# EAGLE design arbotixP (EAGLE 5.10)
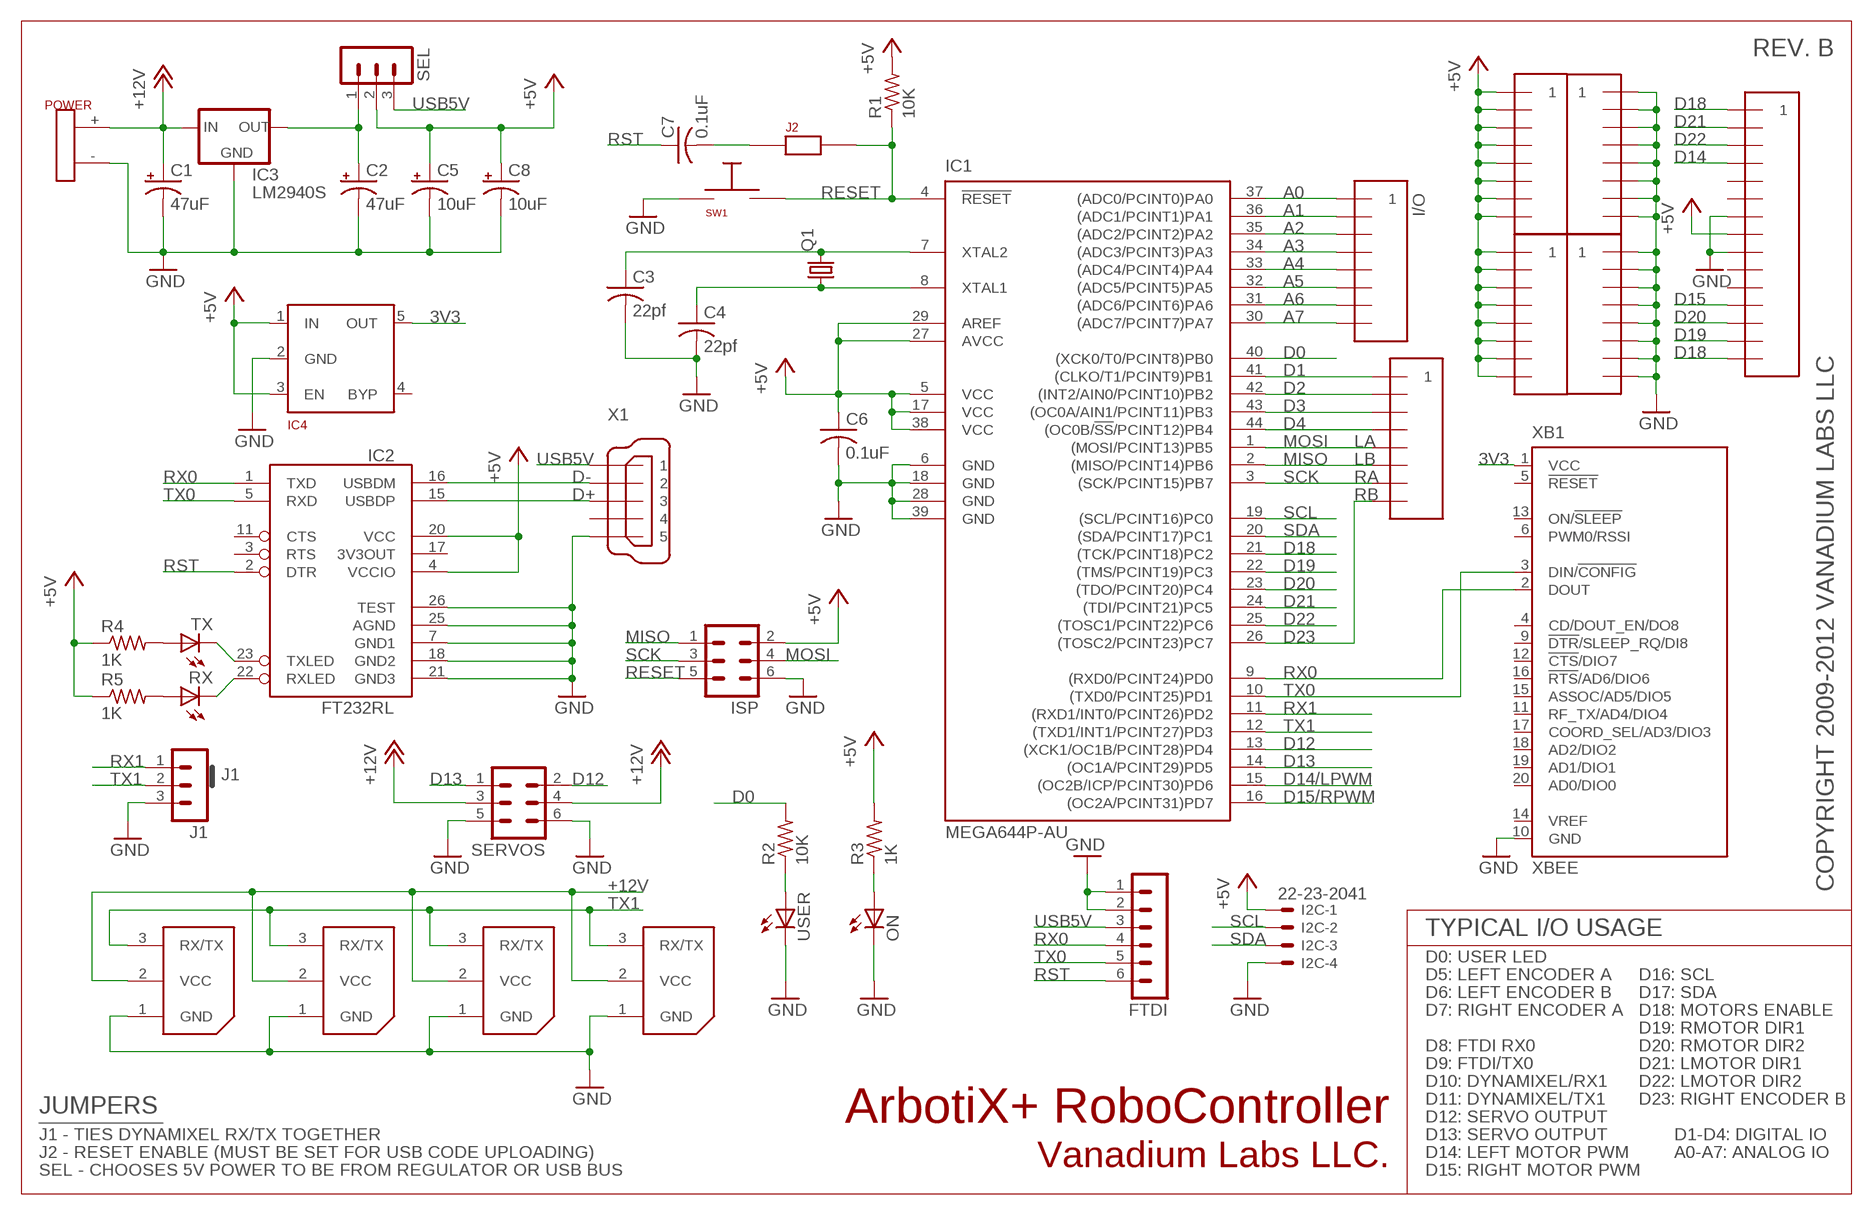
[diagram p0: schematic, sheet 1]

## Parts
AX1  WM18887-ND  [BIOLOID]
AX2  WM18887-ND  [BIOLOID]
AX3  WM18887-ND  [BIOLOID]
AX4  WM18887-ND  [BIOLOID]
C1  47uF  CPOL-USTT2D5  [TT2D5]
C2  47uF  CPOL-USTT2D5  [TT2D5]
C3  22pf  C-USC0603  [C0603]
C4  22pf  C-USC0603  [C0603]
C5  10uF  CPOL-USTT2D5  [TT2D5]
C6  0.1uF  C-USC0603  [C0603]
C7  0.1uF  C-USC0603  [C0603]
C8  10uF  CPOL-USTT2D5  [TT2D5]
FTDI  MA06-1  [MA06-1]
I2C  22-23-2041  [22-23-2041]
IC1  MEGA644P-AU  MEGA164P/324P/644P-AU  [TQFP44]
IC2  FT232RL  FT232RL-BASICSSOP  [SSOP28DB]
IC3  LM2940S  [TO220S]
IC4  MIC5205-3.3  [SOT-23-5]
ISP  MA03-2  [MA03-2]
J1  MA03-1  [MA03-1]
J2  JUMPER  [2-PIN]
ON  LEDCHIP-LED0805  [CHIP-LED0805]
POWER  POWER  [POWER]
Q1  HC49/S  [HC49/S]
R1  10K  R-US_R0805  [R0805]
R2  10K  R-US_R0805  [R0805]
R3  1K  R-US_R0805  [R0805]
R4  1K  R-US_R0603  [R0603]
R5  1K  R-US_R0603  [R0603]
RX  LEDCHIP-LED0603  [CHIP-LED0603]
SEL  MA03-1  [MA03-1]
SERVOS  MA03-2  [MA03-2]
SW1  400-1646-ND  [MINISW]
TX  LEDCHIP-LED0603  [CHIP-LED0603]
U$1  HEADER15  [1X15]
U$2  HEADER8  [1X8]
U$5  HEADER8  [1X8]
U$8  HEADER16  [2X8]
U$9  HEADER16  [2X8]
USER  LEDCHIP-LED0805  [CHIP-LED0805]
X1  MINI-USB-UX60-MB-5ST  [UX60-MB-5ST]
XB1  XBEE  [XBEE]

## Nets
3V3: IC4.5(OUT) XB1.1(VCC)
+5V: C5.+ C6.1 C8.+ I2C.1 IC1.5(VCC) IC1.17(VCC) IC1.27(AVCC) IC1.29(AREF) IC1.38(VCC) IC2.4(VCCIO) IC2.20(VCC) IC4.1(IN) IC4.3(EN) ISP.2 R1.2 R3.2 R4.1 R5.1 SEL.2 U$1.P$8 U$8.P$1 U$8.P$2 U$8.P$3 U$8.P$4 U$8.P$5 U$8.P$6 U$8.P$7 U$8.P$8 U$9.P$1 U$9.P$2 U$9.P$3 U$9.P$4 U$9.P$5 U$9.P$6 U$9.P$7 U$9.P$8
+12V: AX1.2(VCC) AX2.2(VCC) AX3.2(VCC) AX4.2(VCC) C1.+ IC3.1(IN) POWER.+ SERVOS.3 SERVOS.4
A0: IC1.37((ADC0/PCINT0)PA0) U$5.P$1
A1: IC1.36((ADC1/PCINT1)PA1) U$5.P$2
A2: IC1.35((ADC2/PCINT2)PA2) U$5.P$3
A3: IC1.34((ADC3/PCINT3)PA3) U$5.P$4
A4: IC1.33((ADC4/PCINT4)PA4) U$5.P$5
A5: IC1.32((ADC5/PCINT5)PA5) U$5.P$6
A6: IC1.31((ADC6/PCINT6)PA6) U$5.P$7
A7: IC1.30((ADC7/PCINT7)PA7) U$5.P$8
D0: IC1.40((XCK0/T0/PCINT8)PB0) R2.2
D1: IC1.41((CLKO/T1/PCINT9)PB1) U$2.P$1
D2: IC1.42((INT2/AIN0/PCINT10)PB2) U$2.P$2
D3: IC1.43((OC0A/AIN1/PCINT11)PB3) U$2.P$3
D4: IC1.44((OC0B/!SS!/PCINT12)PB4) U$2.P$4
D12: IC1.13((XCK1/OC1B/PCINT28)PD4) SERVOS.2
D13: IC1.14((OC1A/PCINT29)PD5) SERVOS.1
D14: IC1.15((OC2B/ICP/PCINT30)PD6) U$1.P$4
D15: IC1.16((OC2A/PCINT31)PD7) U$1.P$12
D18: IC1.21((TCK/PCINT18)PC2) U$1.P$1 U$1.P$15
D19: IC1.22((TMS/PCINT19)PC3) U$1.P$14
D20: IC1.23((TDO/PCINT20)PC4) U$1.P$13
D21: IC1.24((TDI/PCINT21)PC5) U$1.P$2
D22: IC1.25((TOSC1/PCINT22)PC6) U$1.P$3
D23: IC1.26((TOSC2/PCINT23)PC7) U$2.P$8
D+: IC2.15(USBDP) X1.3
D-: IC2.16(USBDM) X1.2
GND: AX1.1(GND) AX2.1(GND) AX3.1(GND) AX4.1(GND) C1.- C2.- C3.2 C4.2 C5.- C6.2 C8.- FTDI.1 FTDI.2 I2C.4 IC1.6(GND) IC1.18(GND) IC1.28(GND) IC1.39(GND) IC2.7(GND1) IC2.18(GND2) IC2.21(GND3) IC2.25(AGND) IC2.26(TEST) IC3.2(GND) IC4.2(GND) ISP.6 J1.3 ON.C POWER.- SERVOS.5 SERVOS.6 SW1.2 U$1.P$7 U$1.P$9 U$8.P$9 U$8.P$10 U$8.P$11 U$8.P$12 U$8.P$13 U$8.P$14 U$8.P$15 U$8.P$16 U$9.P$9 U$9.P$10 U$9.P$11 U$9.P$12 U$9.P$13 U$9.P$14 U$9.P$15 U$9.P$16 USER.C X1.5 XB1.10(GND)
MISO: IC1.2((MISO/PCINT14)PB6) ISP.1 U$2.P$6
MOSI: IC1.1((MOSI/PCINT13)PB5) ISP.4 U$2.P$5
N$1: C3.1 IC1.7(XTAL2) Q1.2
N$2: R2.1 USER.A
N$4: C4.1 IC1.8(XTAL1) Q1.1
N$7: C7.2 J2.P$1
N$10: R5.2 RX.A
N$11: R4.2 TX.A
N$17: C2.+ IC3.3(OUT) SEL.1
N$44: IC2.23(TXLED) TX.C
N$45: IC2.22(RXLED) RX.C
N$47: ON.A R3.1
RESET: IC1.4(!RESET) ISP.5 J2.P$2 R1.1 SW1.1
RST: C7.1 FTDI.6 IC2.2(DTR)
RX0: FTDI.4 IC1.9((RXD0/PCINT24)PD0) IC2.1(TXD) XB1.2(DOUT)
RX1: IC1.11((RXD1/INT0/PCINT26)PD2) J1.1
SCK: IC1.3((SCK/PCINT15)PB7) ISP.3 U$2.P$7
SCL: I2C.2 IC1.19((SCL/PCINT16)PC0)
SDA: I2C.3 IC1.20((SDA/PCINT17)PC1)
TX0: FTDI.5 IC1.10((TXD0/PCINT25)PD1) IC2.5(RXD) XB1.3(DIN/!CONFIG)
TX1: AX1.3(RX/TX) AX2.3(RX/TX) AX3.3(RX/TX) AX4.3(RX/TX) IC1.12((TXD1/INT1/PCINT27)PD3) J1.2
USB5V: FTDI.3 SEL.3 X1.1
Unconnected: IC2.3(RTS) IC2.11(CTS) IC2.17(3V3OUT) IC4.4(BYP) U$1.P$5 U$1.P$6 U$1.P$10 U$1.P$11 X1.4 XB1.4(CD/DOUT_EN/DO8) XB1.5(!RESET) XB1.6(PWM0/RSSI) XB1.9(!DTR!/SLEEP_RQ/DI8) XB1.11(RF_TX/AD4/DIO4) XB1.12(!CTS!/DIO7) XB1.13(ON/!SLEEP) XB1.14(VREF) XB1.15(ASSOC/AD5/DIO5) XB1.16(!RTS!/AD6/DIO6) XB1.17(COORD_SEL/AD3/DIO3) XB1.18(AD2/DIO2) XB1.19(AD1/DIO1) XB1.20(AD0/DIO0)

## Notes on the sheet
- REV. B
- I/O
- LA
- LB
- RA
- RB
- J1 | D14/LPWM
- D15/RPWM
- COPYRIGHT 2009-2012 VANADIUM LABS LLC
- TYPICAL I/O USAGE
- D0: USER LED
- D5: LEFT ENCODER A | D16: SCL
- D6: LEFT ENCODER B | D17: SDA
- D7: RIGHT ENCODER A | D18: MOTORS ENABLE
- D19: RMOTOR DIR1
- D8: FTDI RX0 | D20: RMOTOR DIR2
- D9: FTDI/TX0 | D21: LMOTOR DIR1
- ArbotiX+ RoboController | D10: DYNAMIXEL/RX1 | D22: LMOTOR DIR2
- D11: DYNAMIXEL/TX1 | D23: RIGHT ENCODER B
- JUMPERS
- D12: SERVO OUTPUT
- J1 - TIES DYNAMIXEL RX/TX TOGETHER | Vanadium Labs LLC. | D13: SERVO OUTPUT | D1-D4: DIGITAL IO
- J2 - RESET ENABLE (MUST BE SET FOR USB CODE UPLOADING) | D14: LEFT MOTOR PWM | A0-A7: ANALOG IO
- SEL - CHOOSES 5V POWER TO BE FROM REGULATOR OR USB BUS | D15: RIGHT MOTOR PWM

## Library data of the parts
AX1-AX4 = robots:WM18887-ND: Bioloid Bus Header Digikey Part No: WM18887-ND Molex/Waldom Electronics Corp 22-03-5035
C1 C2 C5 C8 = rcl:CPOL-US: POLARIZED CAPACITOR, American symbol
C3 C4 C6 C7 = rcl:C-US: CAPACITOR, American symbol
FTDI = con-lstb:MA06-1: PIN HEADER
I2C = con-molex:22-23-2041: .100" (2.54mm) Center Header - 4 Pin
IC1 = avr:MEGA164P/324P/644P-AU
IC2 = SparkFun:FT232RL-BASIC: USB UART This is the simplified version of the FT232RL unit. Only what you need, nothing you don't. Spark Fun Electronics SKU : COM-00650
IC3 = robots:LM2940: LM2940 LDO REGULATOR
IC4 = robots:MIC5205-3.3
ISP SERVOS = con-lstb:MA03-2: PIN HEADER
J1 SEL = con-lstb:MA03-1: PIN HEADER
J2 = robots:JUMPER
ON RX TX USER = led:LED: LED OSRAM: - CHIPLED LG R971, LG N971, LY N971, LG Q971, LY Q971, LO R971, LY R971 LH N974, LH R974 LS Q976, LO Q976, LY Q976 LO Q996 - Hyper CHIPLED LW Q18S LB Q993, LB Q99A, LB R99A - SideLED LS A670, LO A670, LY A670, LG A670, LP A670 LB A673, LV A673, LT A673, LW A673 LH A674 LY A675 LS A676, LA A676, LO A676, LY A676, LW A676 LS A679, LY A679, LG A679 - Hyper Micro SIDELED® LS Y876, LA Y876, LO Y876, LY Y876 LT Y87S - SmartLED LW L88C, LW L88S LB L89C, LB L89S, LG L890 LS L89K, LO L89K, LY L89K LS L896, LA L896, LO L896, LY L896 - TOPLED LS T670, LO T670, LY T670, LG T670, LP T670 LSG T670, LSP T670, LSY T670, LOP T670, LYG T670 LG T671, LOG T671, LSG T671 LB T673, LV T673, LT T673, LW T673 LH T674 LS T676, LA T676, LO T676, LY T676, LB T676, LH T676, LSB T676, LW T676 LB T67C, LV T67C, LT T67C, LS T67K, LO T67K, LY T67K, LW E67C LS E67B, LA E67B, LO E67B, LY E67B, LB E67C, LV E67C, LT E67C LW T67C LS T679, LY T679, LG T679 LS T770, LO T770, LY T770, LG T770, LP T770 LB T773, LV T773, LT T773, LW T773 LH T774 LS E675, LA E675, LY E675, LS T675 LS T776, LA T776, LO T776, LY T776, LB T776 LHGB T686 LT T68C, LB T68C - Hyper Mini TOPLED® LB M676 - Mini TOPLED Santana® LG M470 LS M47K, LO M47K, LY M47K Source: http://www.osram.convergy.de LUXEON: - LUMILED® LXK2-PW12-R00, LXK2-PW12-S00, LXK2-PW14-U00, LXK2-PW14-V00 LXK2-PM12-R00, LXK2-PM12-S00, LXK2-PM14-U00 LXK2-PE12-Q00, LXK2-PE12-R00, LXK2-PE12-S00, LXK2-PE14-T00, LXK2-PE14-U00 LXK2-PB12-K00, LXK2-PB12-L00, LXK2-PB12-M00, LXK2-PB14-N00, LXK2-PB14-P00, LXK2-PB14-Q00 LXK2-PR12-L00, LXK2-PR12-M00, LXK2-PR14-Q00, LXK2-PR14-R00 LXK2-PD12-Q00, LXK2-PD12-R00, LXK2-PD12-S00 LXK2-PH12-R00, LXK2-PH12-S00 LXK2-PL12-P00, LXK2-PL12-Q00, LXK2-PL12-R00 Source: www.luxeon.com KINGBRIGHT: KA-3528ASYC Source: www.kingbright.com
POWER = robots:POWER
Q1 = crystal:HC49/S: CRYSTAL
R1-R5 = rcl:R-US_: RESISTOR, American symbol
SW1 = robots:400-1646-ND: Mini Switch
U$1 = robots:HEADER15
U$2 U$5 = robots:HEADER8
U$8 U$9 = robots:HEADER16
X1 = con-hirose:MINI-USB-: MINI USB Connector Source: http://www.hirose.co.jp/cataloge_hp/e24000019.pdf
XB1 = maxstream:XBEE: XBee (TM) /XBee-PRO(TM) OEM RF Modules Source: MaxStream, Inc. xbee_productmanual.pdf

## Board
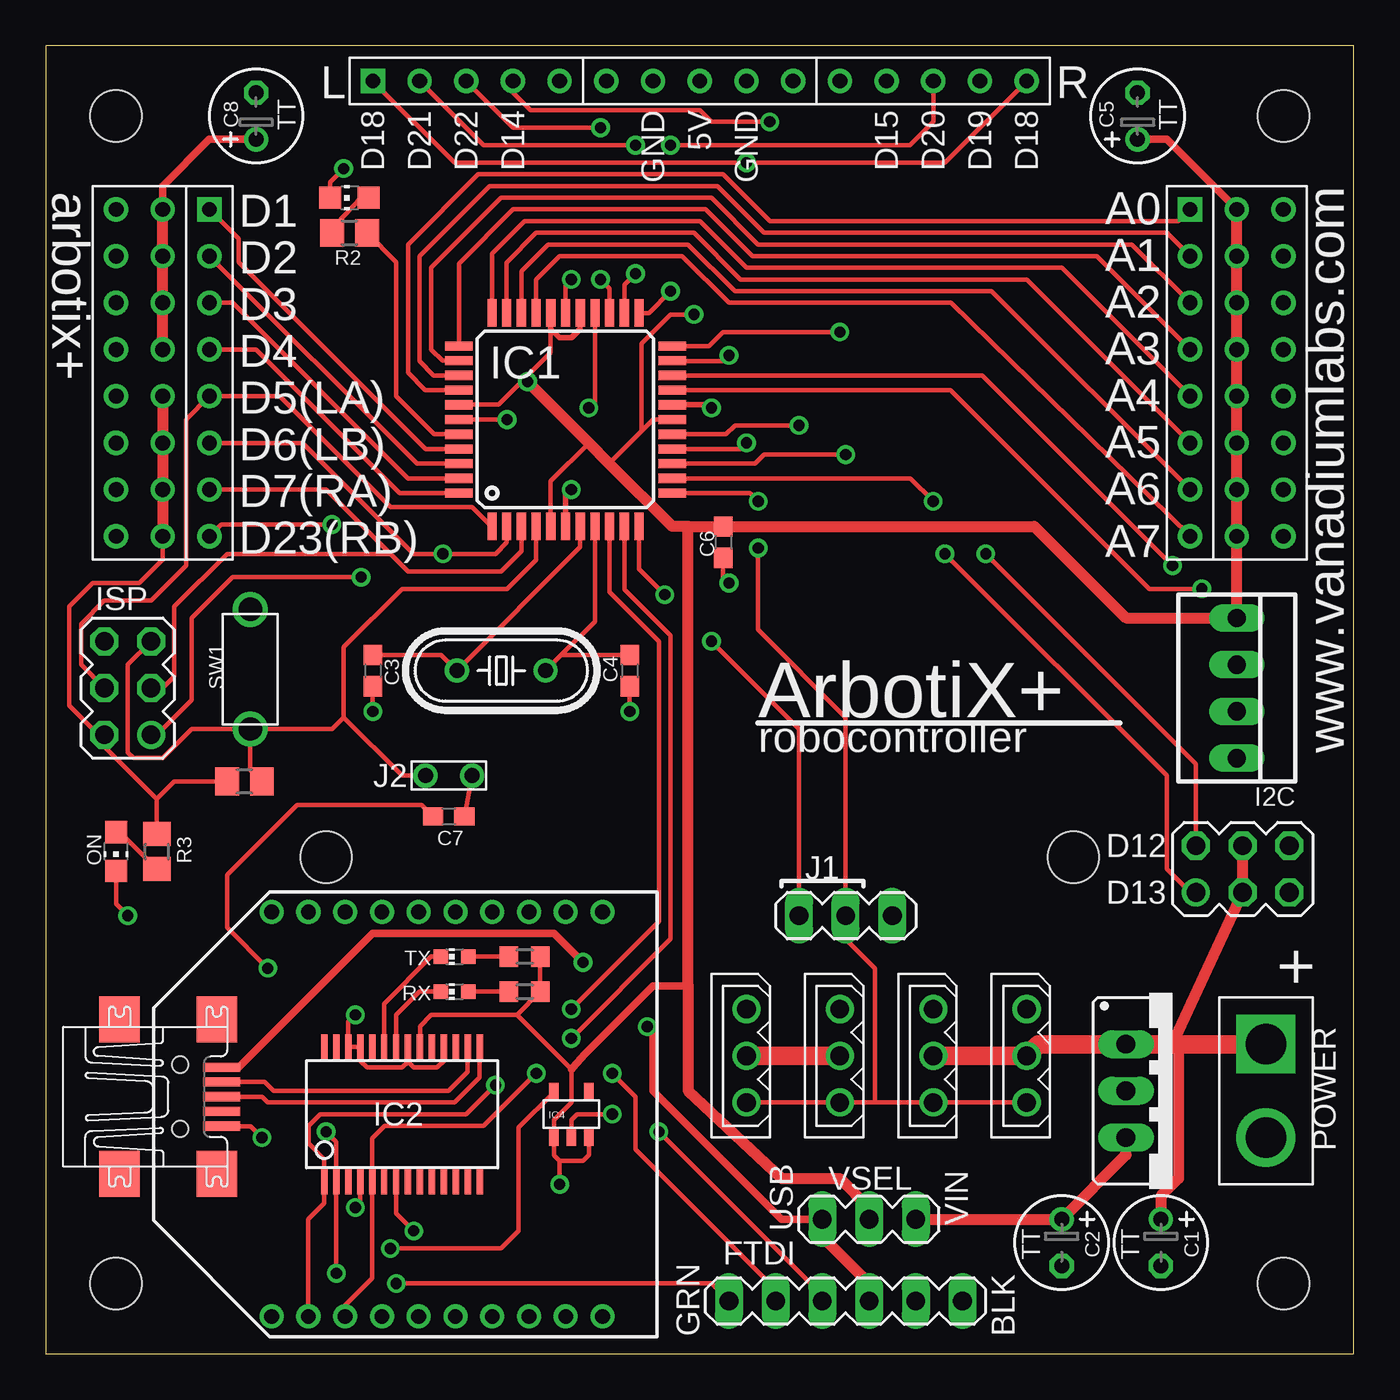
[diagram p1: board, top side]
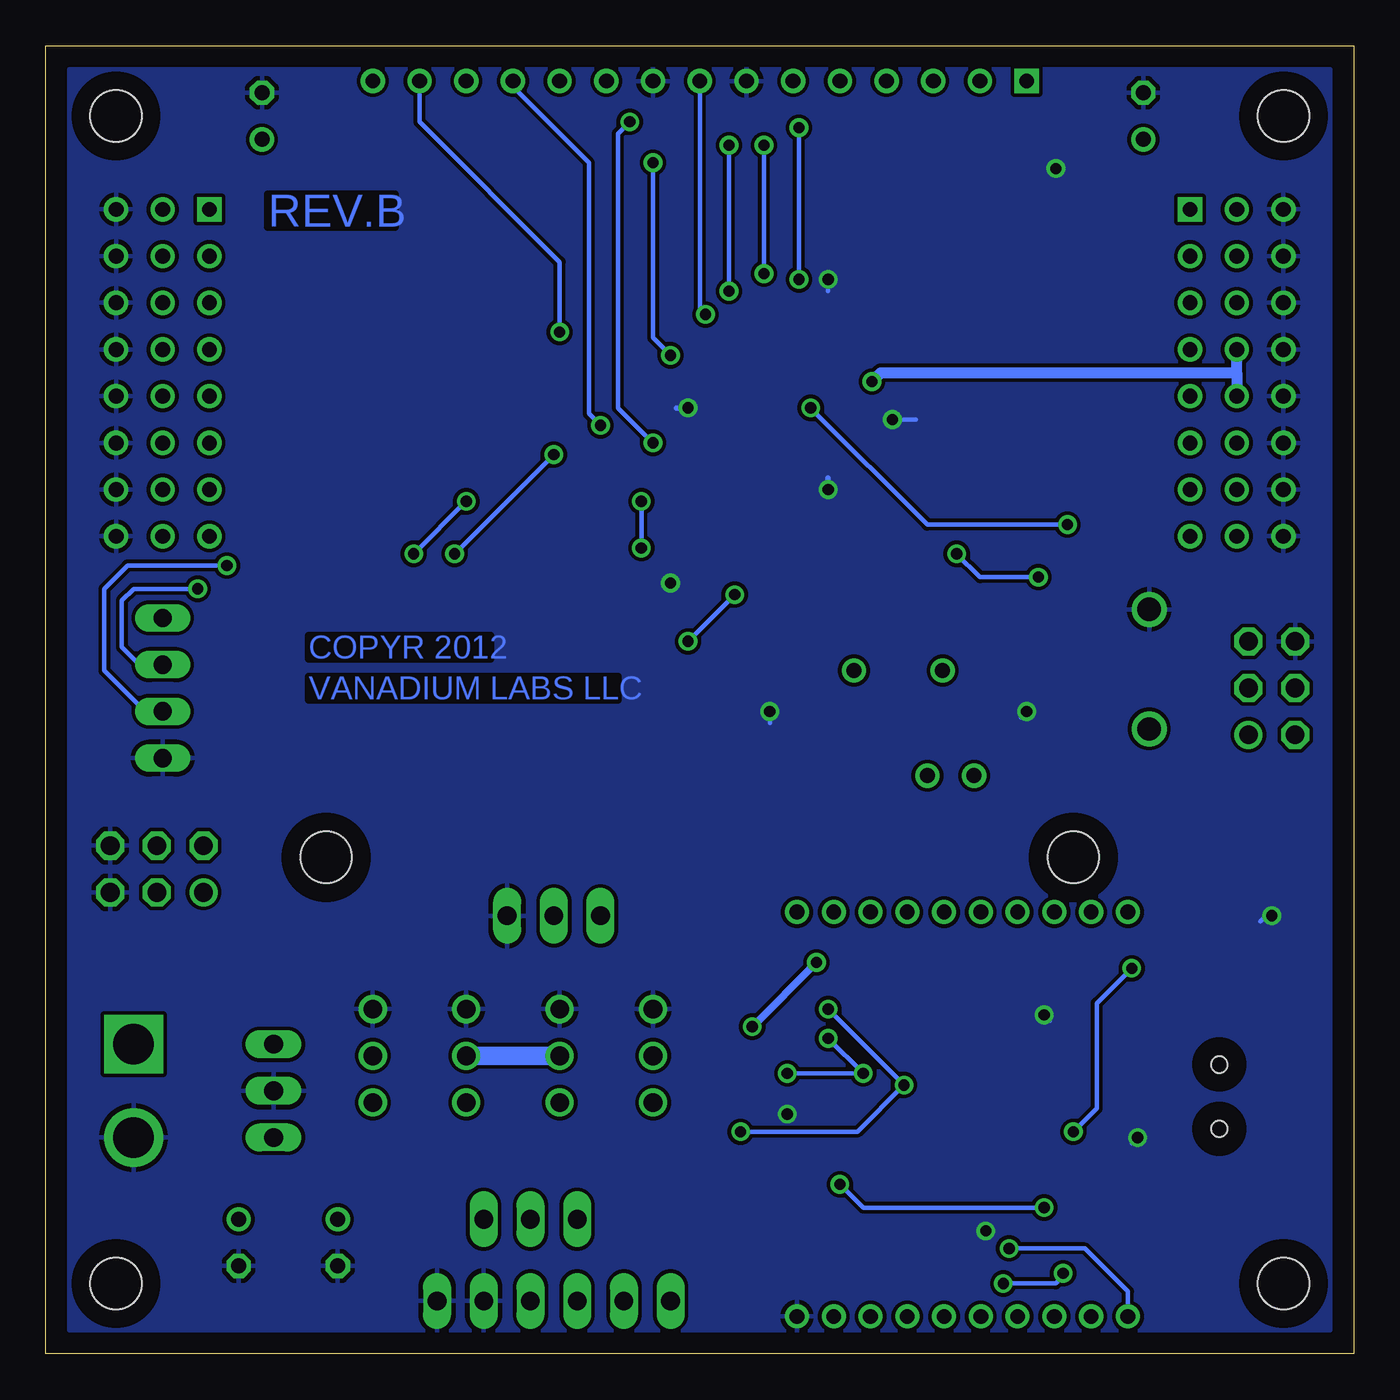
[diagram p2: board, bottom side, seen from below]

Size 71.12 x 71.12 mm. Coordinates in mm from the lower left corner, seen from the top.
Outline: 0,0 71.12,0 71.12,71.12 0,71.12 0,0
Copper layers (1*16): Top 0.035mm / dielectric 1.5mm / Bottom 0.035mm
Design rules "default *": minimum track width 8mil, minimum drill 24mil, track to track 8mil, track to pad 8mil, pad to pad 8mil, via to via 8mil, smd to smd 8mil, copper to edge 40mil, drill to drill 8mil, minimum pad ring 10mil, minimum via ring 8mil, stop-mask expansion 4mil, vias tented up to drill 24mil, thermal gap 10mil
Holes 2.79 mm at 67.31,3.81 3.81,3.81 3.81,67.31 67.31,67.31
Holes 2.8 mm at 15.24,26.99 55.88,26.99

### Footprints (pad centres in the part's own frame; a part is rotated, then mirrored left to right if it is on the bottom)
BIOLOID = drill 1.016 round: 1 0,0; 2 2.54,0; 3 5.08,0
TT2D5 = drill 0.813 round: + -1.27,0 | drill 0.813 octagon: - 1.27,0
C0603 = smd 1.1 x 1: 1 -0.85,0; 2 0.85,0
MA06-1 = drill 1.016 long: 1 -6.35,0; 2 -3.81,0; 3 -1.27,0; 4 1.27,0; 5 3.81,0; 6 6.35,0
22-23-2041 = drill 1 long: 1 -3.81,0; 2 -1.27,0; 3 1.27,0; 4 3.81,0
TQFP44 = smd 1.5 x 0.5: 1 -5.8,4; 2 -5.8,3.2; 3 -5.8,2.4; 4 -5.8,1.6; 5 -5.8,0.8; 6 -5.8,0; 7 -5.8,-0.8; 8 -5.8,-1.6; 9 -5.8,-2.4; 10 -5.8,-3.2; 11 -5.8,-4; 23 5.8,-4; 24 5.8,-3.2; 25 5.8,-2.4; 26 5.8,-1.6; 27 5.8,-0.8; 28 5.8,0; 29 5.8,0.8; 30 5.8,1.6; 31 5.8,2.4; 32 5.8,3.2; 33 5.8,4 | smd 0.5 x 1.5: 12 -4,-5.8; 13 -3.2,-5.8; 14 -2.4,-5.8; 15 -1.6,-5.8; 16 -0.8,-5.8; 17 0,-5.8; 18 0.8,-5.8; 19 1.6,-5.8; 20 2.4,-5.8; 21 3.2,-5.8; 22 4,-5.8; 34 4,5.8; 35 3.2,5.8; 36 2.4,5.8; 37 1.6,5.8; 38 0.8,5.8; 39 0,5.8; 40 -0.8,5.8; 41 -1.6,5.8; 42 -2.4,5.8; 43 -3.2,5.8; 44 -4,5.8
SSOP28DB = smd 0.348 x 1.397: 1 -4.225,-3.656; 2 -3.575,-3.656; 3 -2.925,-3.656; 4 -2.275,-3.656; 5 -1.625,-3.656; 6 -0.975,-3.656; 7 -0.325,-3.656; 8 0.325,-3.656; 9 0.975,-3.656; 10 1.625,-3.656; 11 2.275,-3.656; 12 2.925,-3.656; 13 3.575,-3.656; 14 4.225,-3.656; 15 4.225,3.656; 16 3.575,3.656; 17 2.925,3.656; 18 2.275,3.656; 19 1.625,3.656; 20 0.975,3.656; 21 0.325,3.656; 22 -0.325,3.656; 23 -0.975,3.656; 24 -1.625,3.656; 25 -2.275,3.656; 26 -2.925,3.656; 27 -3.575,3.656; 28 -4.225,3.656
TO220S = drill 1.016 long: 1 -2.54,1.27; 2 0,1.27; 3 2.54,1.27
SOT-23-5 = smd 0.508 x 1.016: 1 -0.95,-1.2; 2 0,-1.2; 3 0.95,-1.2; 4 0.95,1.2; 5 -0.95,1.2
MA03-2 = drill 1.016 round: 1 -2.54,-1.27 | drill 1.016 octagon: 2 -2.54,1.27; 3 0,-1.27; 4 0,1.27; 5 2.54,-1.27; 6 2.54,1.27
MA03-1 = drill 1.016 long: 1 -2.54,0; 2 0,0; 3 2.54,0
2-PIN = drill 0.813 round: P$1 -1.27,0; P$2 1.27,0
CHIP-LED0805 = smd 1.2 x 1.2: A 0,-1.05; C 0,1.05
POWER = drill 2.184 square: + 0,0 | drill 2.184 round: - 5.08,0
HC49/S = drill 0.813 round: 1 -2.413,0; 2 2.413,0
R0805 = smd 1.3 x 1.5: 1 -0.95,0; 2 0.95,0
R0603 = smd 1 x 1.1: 1 -0.85,0; 2 0.85,0
CHIP-LED0603 = smd 0.8 x 0.8: A 0,-0.75; C 0,0.75
MINISW = drill 1.27 round: 1 0,0; 2 6.5,0
1X15 = drill 0.813 square: P$1 0,0 | drill 0.813 round: P$2 2.54,0; P$3 5.08,0; P$4 7.62,0; P$5 10.16,0; P$6 12.7,0; P$7 15.24,0; P$8 17.78,0; P$9 20.32,0; P$10 22.86,0; P$11 25.4,0; P$12 27.94,0; P$13 30.48,0; P$14 33.02,0; P$15 35.56,0
1X8 = drill 0.813 square: P$1 0,0 | drill 0.813 round: P$2 2.54,0; P$3 5.08,0; P$4 7.62,0; P$5 10.16,0; P$6 12.7,0; P$7 15.24,0; P$8 17.78,0
2X8 = drill 0.813 round: P$1 0,0; P$2 2.54,0; P$3 5.08,0; P$4 7.62,0; P$5 10.16,0; P$6 12.7,0; P$7 15.24,0; P$8 17.78,0; P$9 0,2.54; P$10 2.54,2.54; P$11 5.08,2.54; P$12 7.62,2.54; P$13 10.16,2.54; P$14 12.7,2.54; P$15 15.24,2.54; P$16 17.78,2.54
UX60-MB-5ST = smd 2 x 0.5: 1 2.25,1.6; 2 2.25,0.8; 3 2.25,0; 4 2.25,-0.8; 5 2.25,-1.6 | smd 2.2 x 2.5: M1 -3.3,-4.2; M2 -3.3,4.2; M3 2,4.2; M4 2,-4.2 | hole 0.9: 0,-1.75; 0,1.75
XBEE = drill 0.8 pad 1.27 round: 1 -11,9; 2 -11,7; 3 -11,5; 4 -11,3; 5 -11,1; 6 -11,-1; 7 -11,-3; 8 -11,-5; 9 -11,-7; 10 -11,-9; 11 11,-9; 12 11,-7; 13 11,-5; 14 11,-3; 15 11,-1; 16 11,1; 17 11,3; 18 11,5; 19 11,7; 20 11,9

### Placement (x,y rotation side)
AX1  48.26,18.73 270 top
AX2  53.34,18.73 270 top
AX3  43.18,18.73 270 top
AX4  38.1,18.73 270 top
C1  60.64,6.03 270 top
C2  55.24,6.03 270 top
C3  17.78,37.15 270 top
C4  31.75,37.15 270 top
C5  59.37,67.31 90 top
C6  36.83,44.13 270 top
C7  21.91,29.21 0 top
C8  11.43,67.31 90 top
FTDI  43.5,2.86 180 top
I2C  64.77,36.2 270 top
IC1  28.26,50.8 90 top
IC2  19.37,13.02 0 top
IC3  57.47,14.29 270 top
IC4  28.57,13.02 0 top
ISP  4.45,36.2 90 top
J1  43.5,23.81 0 top
J2  21.91,31.43 180 top
ON  3.81,27.3 180 top
POWER  66.36,16.83 270 top
Q1  24.77,37.15 180 top
R1  10.79,31.11 180 top
R2  16.51,60.96 0 top
R3  6.03,27.3 90 top
R4  26.04,21.59 180 top
R5  26.04,19.68 180 top
RX  22.23,19.68 90 top
SEL  44.77,7.3 180 top
SERVOS  65.09,26.35 0 top
SW1  11.11,33.97 90 top
TX  22.23,21.59 90 top
U$1  17.78,69.22 0 top
U$2  8.89,62.23 270 top
U$5  62.23,62.23 270 top
U$8  6.35,44.45 90 top
U$9  64.77,62.23 270 top
USER  16.51,62.87 90 top
X1  7.3,13.97 0 top
XB1  21.27,13.02 90 top

### Tracks (layer width: path | path; a pad name or v marks a point on that pad's centre or on a via)
3V3  (via drill 0.61)
  Top 0.254: IC4.5 25.72,12.31 25.72,6.67 24.77,5.71 v18.73,5.71
  Bottom 0.254: XB1.1 12.27,3.38 14.61,5.71 v18.73,5.71
+5V  (via drill 0.61)
  Top 0.254: 27.94,10.48 29.21,10.48 29.53,10.79 IC4.3 | IC2.4 17.09,8.2 v16.83,7.94 | v27.94,9.21 27.94,10.48 | 27.94,10.48 27.62,10.79 IC4.1 27.62,12.7 28.57,13.65 28.57,15.46 25.61,18.41 | R4.1 R5.1 25.61,18.41 | IC1.17 33.02,50.8 32.38,50.16 | 30.64,48.42 32.38,50.16 | IC1.5 27.46,47.46 29.53,49.53 | IC1.38 24.61,51.6 26.04,53.02 27.46,54.45 27.46,55.73 | U$8.P$1 6.35,43.18 5.08,41.91 2.54,41.91 1.27,40.64 1.27,35.24 2.86,33.66 ISP.2 3.17,33.02 6.03,30.16 | IC2.20 20.34,17.8 20.95,18.41 25.61,18.41 | 6.03,30.16 R3.2 | R1.2 6.99,31.11 6.03,30.16 | v35.24,56.52 33.97,56.52 32.38,54.93 32.38,50.16
  Top 0.305: IC1.29 27.46,55.73 27.94,55.24 28.57,55.24 29.06,55.73 IC1.27
  Top 0.406: U$9.P$1 60.96,66.04 C5.+ | U$8.P$8 6.35,63.5 8.89,66.04 C8.+ | 34.92,20 33.02,20 29.31,16.3 28.68,15.56 28.57,15.46
  Top 0.61: U$9.P$1 U$9.P$2 U$9.P$3 U$9.P$4 U$9.P$5 U$9.P$6 U$9.P$7 U$9.P$8 I2C.1 58.74,40.01 53.76,44.98 C6.1 34.92,44.98 | U$8.P$8 U$8.P$7 U$8.P$6 U$8.P$5 | U$8.P$4 U$8.P$3 U$8.P$2 U$8.P$1 | 34.92,44.98 34.08,44.98 30.64,48.42 29.53,49.53 v26.19,52.86 26.04,53.02 | SEL.2 44.77,7.94 43.18,9.53 40.01,9.53 34.92,14.29 34.92,20 34.92,44.98
  Bottom 0.254: v16.83,7.94 26.67,7.94 v27.94,9.21 | U$1.P$8 35.56,56.83 v35.24,56.52
  Bottom 0.61: 6.35,53.34 U$8.P$5 | 6.35,53.34 U$8.P$4 | 6.35,53.34 25.72,53.34 v26.19,52.86
+12V
  Top 0.61: SERVOS.4 SERVOS.3 61.28,16.83 61.59,16.51 61.59,9.53 60.64,8.57 C1.+
  Top 1.016: AX1.2 AX2.2 53.98,16.83 IC3.1 61.28,16.83 POWER.+ | AX4.2 AX3.2
  Bottom 1.016: AX3.2 AX1.2
A0
  Top 0.254: IC1.37 20.62,52.4 19.68,53.34 19.68,60.33 23.5,64.14 36.83,64.14 39.37,61.59 61.59,61.59 U$5.P$1
A1
  Top 0.254: IC1.36 21.09,53.2 20.32,53.98 20.32,59.69 24.13,63.5 36.51,63.5 39.05,60.96 60.96,60.96 U$5.P$2
A2
  Top 0.254: IC1.35 21.57,54 20.95,54.61 20.95,59.05 24.77,62.87 36.2,62.87 38.73,60.33 59.05,60.33 U$5.P$3
A3
  Top 0.254: IC1.34 22.46,59.29 25.4,62.23 35.88,62.23 38.42,59.69 57.15,59.69 U$5.P$4
A4
  Top 0.254: IC1.33 24.26,59.82 26.04,61.59 35.56,61.59 38.1,59.05 55.24,59.05 U$5.P$5
A5
  Top 0.254: IC1.32 25.06,59.35 26.67,60.96 35.24,60.96 37.78,58.42 53.34,58.42 U$5.P$6
A6
  Top 0.254: IC1.31 25.86,58.88 27.3,60.33 34.92,60.33 37.47,57.78 51.44,57.78 U$5.P$7
A7
  Top 0.254: IC1.30 26.66,58.41 27.94,59.69 34.61,59.69 37.15,57.15 49.21,57.15 U$5.P$8
D0
  Top 0.254: IC1.40 21.12,50 19.05,52.07 19.05,59.37 R2.2
D1
  Top 0.254: IC1.41 20.65,49.2 10.48,59.37 10.48,60.64 U$2.P$1
D2
  Top 0.254: IC1.42 20.18,48.4 U$2.P$2
D3
  Top 0.254: IC1.43 19.71,47.6 10.16,57.15 U$2.P$3
D4
  Top 0.254: IC1.44 19.24,46.8 11.43,54.61 U$2.P$4
D12  (via drill 0.61)
  Top 0.254: v51.12,43.5 62.55,32.07 SERVOS.2 | IC1.13 47.02,47.6 v48.26,46.35
  Bottom 0.254: v48.26,46.35 v51.12,43.5
D13  (via drill 0.61)
  Top 0.254: SERVOS.1 62.23,25.08 60.96,26.35 60.96,31.43 v48.9,43.5 | IC1.14 38.56,48.4 39.05,48.9 v43.5,48.9
  Bottom 0.254: v43.5,48.9 v48.9,43.5
D14  (via drill 0.61)
  Top 0.254: U$1.P$4 25.4,68.58 26.35,67.63 35.56,67.63 36.2,66.99 v39.37,66.99 | IC1.15 37.77,49.2 v38.1,49.53
  Bottom 0.254: v39.37,66.99 40.01,66.36 40.01,51.44 v38.1,49.53
D15  (via drill 0.61)
  Top 0.254: IC1.16 36.98,50 37.47,50.48 v40.96,50.48
  Bottom 0.254: U$1.P$12 45.72,68.9 41.59,64.77 41.59,51.12 v40.96,50.48
D18  (via drill 0.61)
  Top 0.254: v37.15,54.29 36.83,53.98 34.08,53.98 IC1.21 | U$1.P$1 22.23,64.77 v38.1,64.77 48.9,64.77 U$1.P$15
  Bottom 0.254: v38.1,64.77 38.1,55.24 v37.15,54.29
D19  (via drill 0.61)
  Top 0.254: IC1.22 36.07,54.8 36.83,55.56 v43.18,55.56
  Bottom 0.254: U$1.P$14 50.8,66.99 43.18,59.37 v43.18,55.56
D20  (via drill 0.61)
  Top 0.254: U$1.P$13 48.26,66.99 46.99,65.72 v33.97,65.72 | IC1.23 32.79,56.6 v33.97,57.78
  Bottom 0.254: v33.97,57.78 v33.97,65.72
D21  (via drill 0.61)
  Top 0.254: IC1.24 31.46,58.13 v32.07,58.74 | v32.07,65.72 23.81,65.72 U$1.P$2
  Bottom 0.254: v32.07,58.74 v32.07,65.72
D22  (via drill 0.61)
  Top 0.254: IC1.25 30.66,57.92 v30.16,58.42 | v30.16,66.67 25.4,66.67 U$1.P$3
  Bottom 0.254: v30.16,58.42 v30.16,66.67
D23  (via drill 0.61)
  Top 0.254: IC1.26 29.86,51.77 v29.53,51.44 | v15.56,45.09 9.53,45.09 U$2.P$8
  Bottom 0.254: v29.53,51.44 23.18,45.09 v15.56,45.09
D+
  Top 0.254: X1.3 11.75,13.97 12.06,13.65 22.23,13.65 23.59,15.02 IC2.15
D-
  Top 0.254: X1.2 11.9,14.77 12.38,14.29 21.91,14.29 22.94,15.32 IC2.16
GND  (via drill 0.61)
  Top 0.254: 17.78,36.03 C3.2 v17.78,34.92 | X1.5 11.12,12.37 v11.75,11.75 | USER.C 15.46,63.72 v16.19,64.45 | IC2.7 19.04,7.63 v20,6.67 | IC4.2 28.57,12.7 28.89,13.02 v30.8,13.02 | 19.68,15.88 19.37,15.56 17.46,15.56 17.09,15.93 IC2.25 IC2.26 16.44,18.03 v16.83,18.41 | 19.68,15.88 IC2.21 | IC2.18 21.64,15.93 21.27,15.56 20,15.56 19.68,15.88 | IC1.28 28.26,58.1 v28.57,58.42 | IC1.39 v25.08,50.8 | C6.2 36.83,42.23 v37.15,41.91 | ON.C 3.81,24.45 v4.45,23.81 | v31.75,34.92 C4.2
  Top 0.305: IC1.18 36.03,51.6 v36.2,51.44 | IC1.6 28.26,46.67 v28.57,46.99
  Bottom 0.254: v11.75,11.75 12.06,11.43 | v16.19,64.45 16.19,64.77 | v30.8,13.02 30.48,13.02 | v16.83,18.41 16.51,18.1 | v28.57,58.42 28.57,57.78 | v25.08,50.8 23.81,50.8 | v4.45,23.81 4.76,23.81 5.08,23.5 | v17.78,34.92 18.1,34.61 | v31.75,34.92 31.75,34.29
  Bottom 0.305: v36.2,51.44 36.83,51.44 | v28.57,46.99 28.57,47.62
  pour Bottom: 1.27,69.85 1.27,1.27 69.85,1.27 69.85,69.85
MISO  (via drill 0.61)
  Top 0.254: IC1.2 25.06,44.11 24.45,43.5 v21.59,43.5 20,43.5 13.97,49.53 U$2.P$6 | ISP.1 6.03,33.66 7.94,35.56 7.94,40.01 10.16,42.23 v17.14,42.23
  Bottom 0.254: v17.14,42.23 20.32,42.23 v21.59,43.5
MOSI
  Top 0.254: IC1.1 24.17,45.09 24.13,45.09 23.18,46.04 18.73,46.04 12.7,52.07 U$2.P$5 7.62,50.8 7.62,42.86 5.71,40.96 3.17,40.96 1.91,39.69 1.91,37.47 ISP.4
N$1
  Top 0.254: C3.1 21.5,38 Q1.2 29.06,43.85 IC1.7
N$2
  Top 0.254: R2.1 15.34,60.96 17.14,62.87 USER.A
N$4
  Top 0.254: 28.03,38 C4.1 | Q1.1 28.03,38 | IC1.8 29.86,39.83 28.03,38
N$7
  Top 0.254: C7.2 J2.P$1
N$10
  Top 0.254: RX.A R5.2
N$11
  Top 0.254: TX.A R4.2
N$17
  Top 0.61: IC3.3 58.74,10.79 C2.+ SEL.1
N$44
  Top 0.254: IC2.23 18.39,19.03 20.95,21.59 TX.C
N$45
  Top 0.254: IC2.22 19.04,18.41 20.32,19.68 RX.C
N$47
  Top 0.254: ON.A 4.03,28.36 R3.1
RESET
  Top 0.254: R1.1 11.11,31.75 SW1.1 | IC1.4 26.66,43.17 25.08,41.59 19.37,41.59 16.19,38.42 16.19,34.61 | 16.19,34.61 15.56,33.97 SW1.1 | J2.P$2 19.37,31.43 16.19,34.61 | SW1.1 7.94,33.97 6.35,32.38 4.76,32.38 4.45,32.7 4.45,37.47 ISP.5
RST  (via drill 0.61)
  Top 0.254: v15.24,12.06 15.79,11.51 IC2.2 v15.79,4.36 | v12.06,20.95 9.84,23.18 9.84,26.04 13.65,29.84 20.42,29.84 C7.1 | FTDI.6 36.2,3.81 v19.05,3.81
  Bottom 0.254: v15.24,12.06 13.97,13.34 13.97,19.05 v12.06,20.95 | v15.79,4.36 15.79,4.21 16.19,3.81 v19.05,3.81
RX0  (via drill 0.61)
  Top 0.254: XB1.2 14.27,7.29 15.14,8.16 IC2.1 15.14,10.57 14.29,11.43 14.29,12.38 14.92,13.02 22.86,13.02 v24.45,14.61 | IC1.9 30.66,41.41 33.34,38.73 33.34,23.5 v28.57,18.73 | FTDI.4 42.23,3.17 v33.34,12.06
  Bottom 0.254: v28.57,18.73 v24.45,14.61 26.99,12.06 v33.34,12.06
RX1  (via drill 0.61)
  Top 0.254: J1.1 40.96,33.97 v36.2,38.73 | IC1.11 32.26,42.67 v33.66,41.27
  Bottom 0.254: v36.2,38.73 v33.66,41.27
SCK
  Top 0.254: IC1.3 25.86,43.64 24.77,42.55 19.68,42.55 18.89,43.34 | U$2.P$7 15.24,46.99 18.89,43.34 | ISP.3 6.35,36.2 6.99,36.83 6.99,40.64 9.84,43.5 18.73,43.5 18.89,43.34
SCL  (via drill 0.61)
  Top 0.254: IC1.19 49.2,52.4 60.01,41.59 v62.87,41.59
  Bottom 0.254: I2C.2 66.04,37.47 66.99,38.42 66.99,40.96 66.36,41.59 v62.87,41.59
SDA  (via drill 0.61)
  Top 0.254: IC1.20 50.94,53.2 v61.28,42.86
  Bottom 0.254: I2C.3 65.72,34.92 67.94,37.15 67.94,41.59 66.67,42.86 v61.28,42.86
TX0  (via drill 0.61)
  Top 0.254: XB1.3 16.27,2.62 17.74,4.09 IC2.5 17.74,11.71 18.41,12.38 23.81,12.38 v26.67,15.24 | IC1.10 31.46,41.57 33.97,39.05 33.97,22.54 v28.57,17.14 | FTDI.5 39.69,3.49 32.07,11.11 32.07,13.97 v30.8,15.24
  Bottom 0.254: v28.57,17.14 v26.67,15.24 v30.8,15.24
TX1  (via drill 0.61)
  Top 0.254: IC1.12 38.29,46.8 v38.73,46.35 | v38.73,43.81 38.73,39.37 43.5,34.61 J1.2 43.5,22.54 45.09,20.95 45.09,13.65 | 45.09,13.65 AX3.3 AX4.3 | 45.09,13.65 AX1.3 AX2.3
  Bottom 0.254: v38.73,43.81 v38.73,46.35
USB5V  (via drill 0.61)
  Top 0.406: X1.1 10.49,15.57 17.78,22.86 27.62,22.86 v29.21,21.27 | v32.7,17.78 33.02,17.46 33.02,14.29 40.01,7.3 SEL.3
  Top 0.61: FTDI.3 44.77,3.81 42.23,6.35 SEL.3
  Bottom 0.406: v29.21,21.27 v32.7,17.78

### Text on the board
Bottom: REV.B | COPYR 2012 | VANADIUM LABS LLC
tPlace: D12 | D13
tNames: L | D18 | D21 | D22 | D14 | GND | 5V | GND | D15 | D20 | D19 | D18 | R | www.vanadiumlabs.com | arbotix+ | A0 | D1 | A1 | D2 | A2 | D3 | A3 | D4 | A4 | D5(LA) | A5 | D6(LB) | A6 | D7(RA) | A7 | D23(RB) | ArbotiX+ | robocontroller | + | VSEL | USB | VIN | GRN | BLK